# Altium schematic sheet Relais.SchDoc
size A4; SheetNumber: 4; SheetTotal: 4
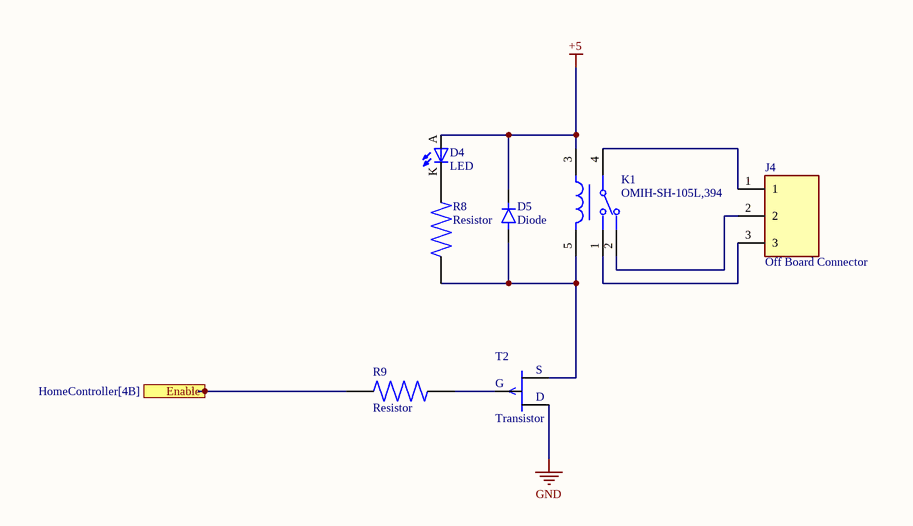
[diagram p0: Relais.SchDoc]

## Parts
D4  LED  [New footprint 1]
D5  Diode  [Diode-Footprint-1]
J4  Off Board Connector  [Off Board Connector-Footprint-1]
K1  OMIH-SH-105L,394  [FP-OMIH-SH-105L_394-MFG]
R8  Resistor  [Resistor-Footprint-1]
R9  Resistor  [Resistor-Footprint-1]
T2  Transistor  [Transistor-Footprint-1]

## Ports
Enable (see HomeController[4B])

## Nets
+5: D4.A D5.K K1.3
GND: T2.2(D)
Enable: R9.1 ; port Enable
NetD4_K: D4.K R8.2
NetD5_A: D5.A K1.5 R8.1 T2.1(S)
NetJ4_1: J4.1 K1.4
NetJ4_2: J4.2 K1.2
NetJ4_3: J4.3 K1.1
NetR9_2: R9.2 T2.3(G)

## Library data of the parts
D4 = CMP-00001-2: 3mm LED
D5 = CMP-00008-1: Generic Diode
J4 = CMP-00012-1: 3 Pin
K1 = CMP-00036-3: Power/Signal Relay, SPDT, Momentary, 0.108A (Coil), 5VDC (Coil), 540mW (Coil), 16A (Contact), 30VDC (Contact), DC Input, AC/DC Output, Through Hole-Straight Mount
R8 R9 = CMP-00014-2: Generic Resistor
T2 = CMP-00000-1: Generic Transistor